# Altium schematic sheet powerSupply.SchDoc
size A4; SheetNumber: 3; SheetTotal: 4
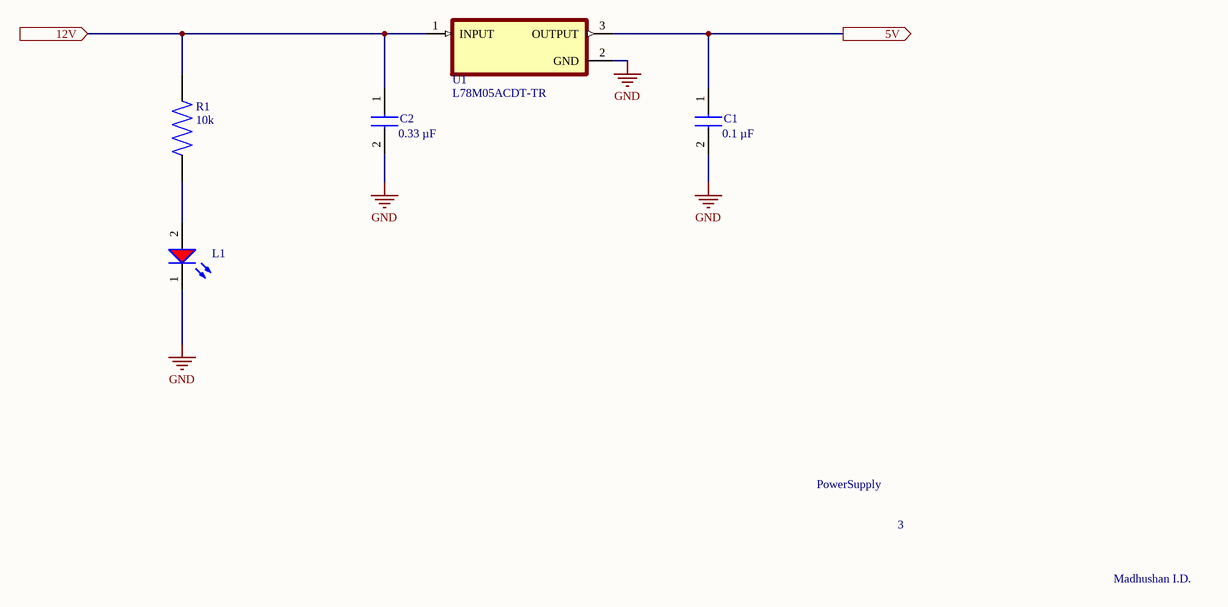
[diagram p0: powerSupply.SchDoc]

## Parts
C1  value 0.1 µF  [C1206]  (hidden comment: C1206C334K1RECAUTO)
C2  Manufacturer_Name: 0.33 µF  [C1206]  (hidden comment: C1206C334K1RECAUTO)
L1  150080SS75000  [WL-SMCW_0805_150080xx75000]  (value not drawn)
R1  value 10k  [RES_ERA8AEB103V]  (hidden comment: ERA8AEB103V)
U1  L78M05ACDT-TR  [DPAK228P972X240-4N]

## Ports
5V (out, see Hierarchy[2B], Atmega328p-AU[2B], Inputs_Outputs[2C]), 12V (in, see Hierarchy[1B], Inputs_Outputs[2A])

## Nets
GND: C1.2 C2.2 L1.1(K) U1.2(GND)
5V: C1.1 U1.3(OUTPUT) ; port 5V
12V: C2.1 R1.2 U1.1(INPUT) ; port 12V
NetL1_2: L1.2(A) R1.1

## Notes on the sheet
- PowerSupply
- 3
- Madhushan I.D.

## Library data of the parts
C1 = C1206C334K1RECAUTO: Capacitor; Datasheet Link: https://content.kemet.com/datasheets/KEM_C1090_X7R_ESD.pdf; Mouser Part Number: 80-C1206C334K1RECAUT; Mouser Price/Stock: https://www.mouser.co.uk/ProductDetail/KEMET/C1206C334K1RECAUTO?qs=MLItCLRbWsx8dVF2h1wzKg%3D%3D; Arrow Part Number: C1206C334K1RECAUTO; Manufacturer_Part_Number: C1206C334K1RECAUTO
C2 = C1206C334K1RECAUTO: Capacitor; Value: 0.33 µF; Datasheet Link: https://content.kemet.com/datasheets/KEM_C1090_X7R_ESD.pdf; Mouser Part Number: 80-C1206C334K1RECAUT; Mouser Price/Stock: https://www.mouser.co.uk/ProductDetail/KEMET/C1206C334K1RECAUTO?qs=MLItCLRbWsx8dVF2h1wzKg%3D%3D; Arrow Part Number: C1206C334K1RECAUTO; Manufacturer_Part_Number: C1206C334K1RECAUTO
L1 = CMP-1426-00010-3: NexarPartId: 29717782; Peak Wavelength: 645nm; Luminous Intensity: 60mcd; Max Junction Temperature (Tj): 95°C; Wavelength: 630nm; Forward Current: 100mA; Max Reverse Voltage (DC): 5V; Color: Red; Lens Style: Clear, Rectangular; Test Current: 20mA; Power Dissipation: 72mW; Viewing Angle: 140°; Forward Voltage: 1.9V; Case Code (Metric): 2012; Max Operating Temperature: 85°C; Mount: Surface Mount; Height: 700µm; Case/Package: 0805; Min Operating Temperature: -40°C; Reverse Voltage: 5V; RoHS: Compliant; Packaging: Tape and Reel; REACH SVHC: Unknown; Case Code (Imperial): 0805; Length: 2mm; Width: 1.25mm; Dominant Wavelength: 630nm
U1 = L78M05ACDT-TR: Linear Voltage Regulator IC 1 Output 500mA DPAK; MF: STMicroelectronics; Availability: Unavailable; MP: L78M05ACDT-TR; Price: None; Value: *; SnapEDA_Link: https://www.snapeda.com/parts/L78M05ACDT-TR/STMicroelectronics/view-part/274303/?ref=snap; Package: TO-252-3 STMicroelectronics
R1 = ERA8AEB103V: Availability: Unavailable; MP: ERA8AEB103V; Price: None; Package: None